# EAGLE design PAPR_02 (EAGLE 7.4.0)
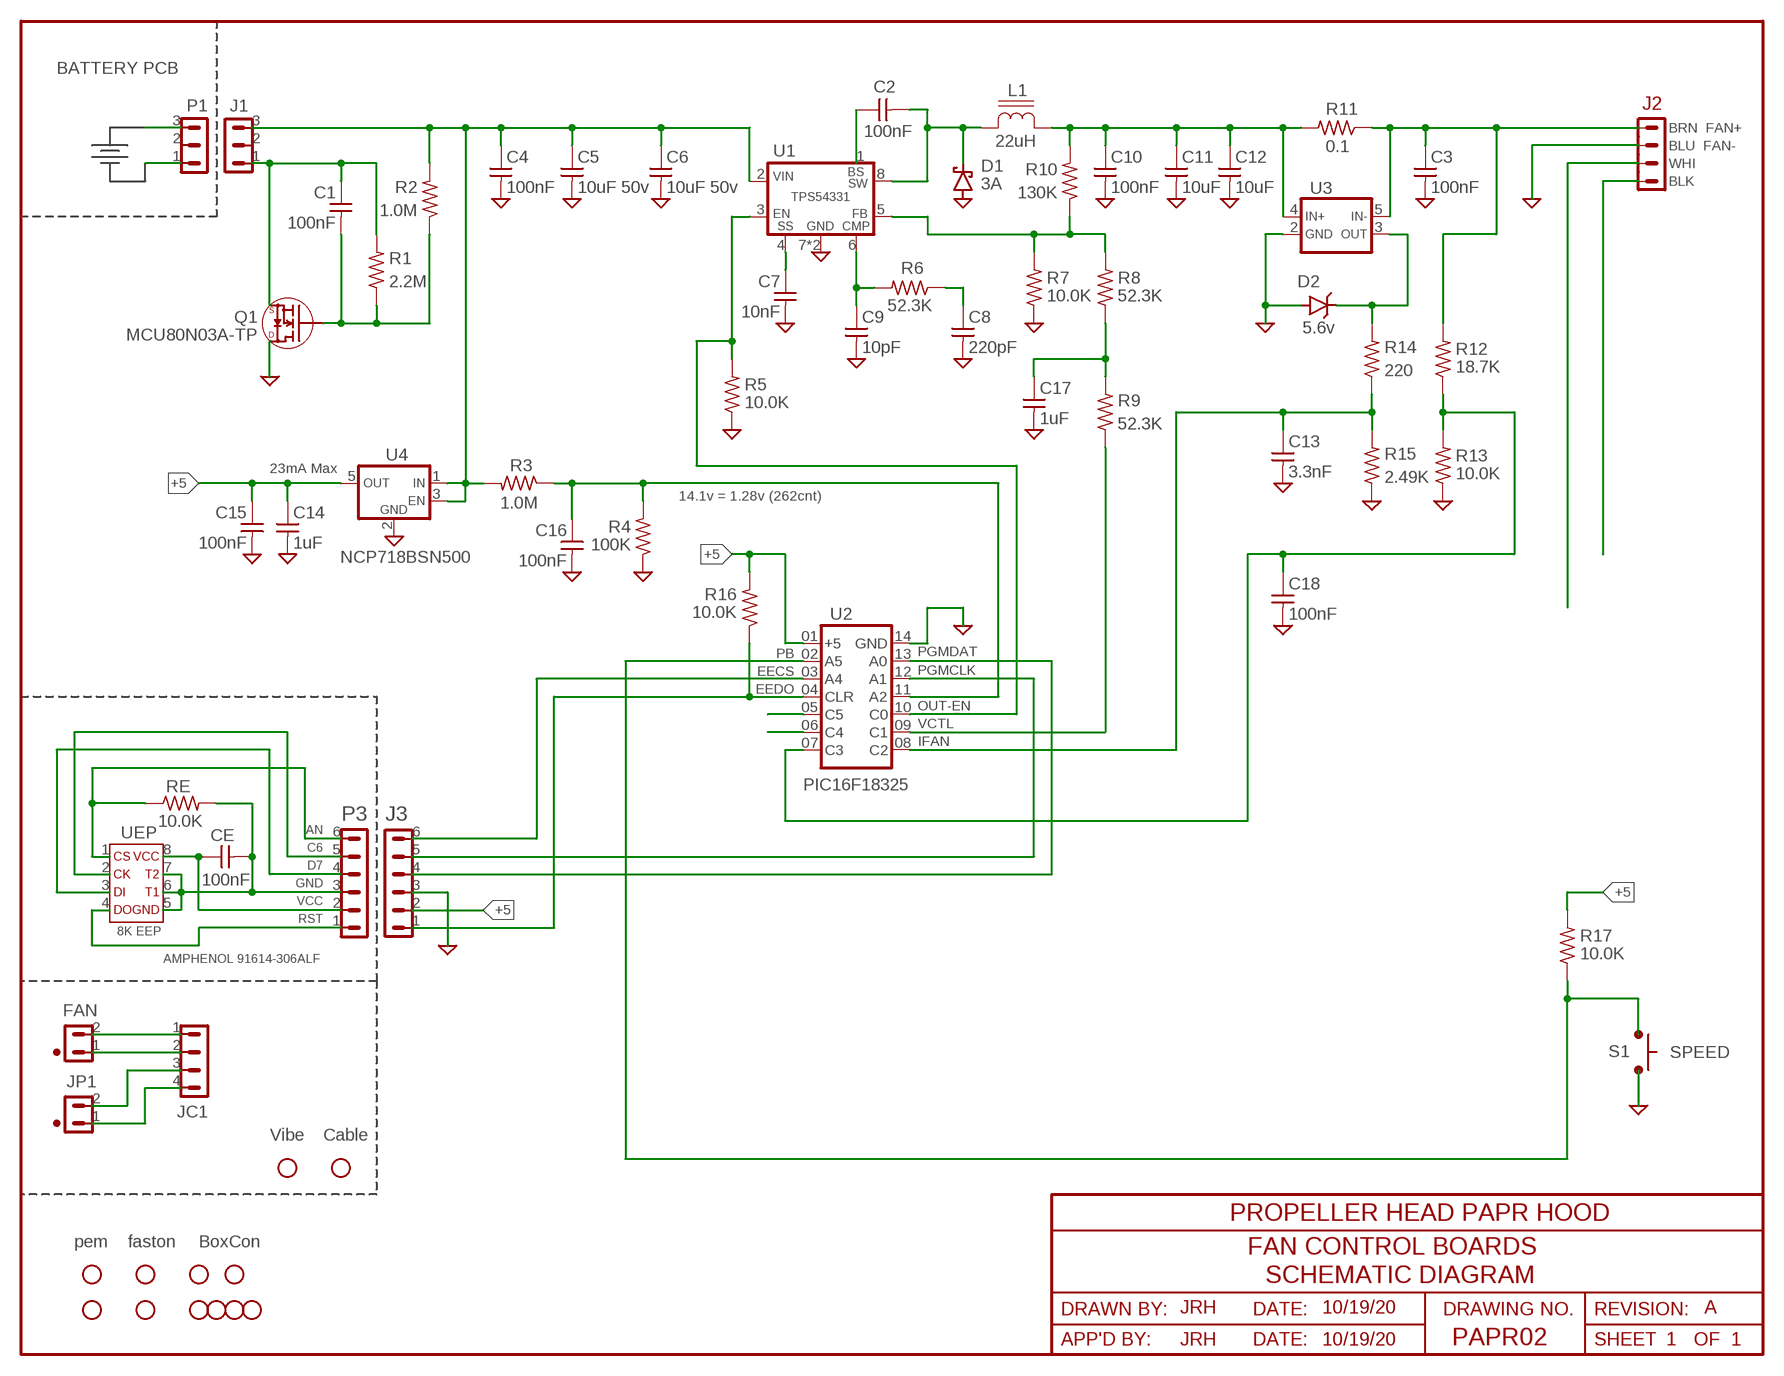
[diagram p0: schematic, sheet 1]

## Parts
BOM1  pem  BOM_ADDER  [BOM_ADDER]
BOM2  pem  BOM_ADDER  [BOM_ADDER]
BOM3  faston  BOM_ADDER  [BOM_ADDER]
BOM4  faston  BOM_ADDER  [BOM_ADDER]
BOM5  vibrator  BOM_ADDER  [BOM_ADDER]
BOM6  BoxCon  BOM_ADDER  [BOM_ADDER]
BOM7  Cable  BOM_ADDER  [BOM_ADDER]
BOM8  Plug  BOM_ADDER  [BOM_ADDER]
BOM9  Pin  BOM_ADDER  [BOM_ADDER]
BOM10  Pin  BOM_ADDER  [BOM_ADDER]
BOM11  Pin  BOM_ADDER  [BOM_ADDER]
BOM12  Pin  BOM_ADDER  [BOM_ADDER]
C1  100nF  C-N0805  [R0805]
C2  100nF  C-N0805  [R0805]
C3  100nF  C-N0805  [R0805]
C4  100nF  C-N0805  [R0805]
C5  10uF 50v  C-N1210  [R1210]
C6  10uF 50v  C-N1210  [R1210]
C7  10nF  C-N0805  [R0805]
C8  220pF  C-N0805  [R0805]
C9  10pF  C-N0805  [R0805]
C10  100nF  C-N0805  [R0805]
C11  10uF  C-N1210  [R1210]
C12  10uF  C-N1210  [R1210]
C13  3.3nF  C-N0805  [R0805]
C14  1uF  C-N0805  [R0805]
C15  100nF  C-N0805  [R0805]
C16  100nF  C-N0805  [R0805]
C17  1uF  C-N0805  [R0805]
C18  100nF  C-N0805  [R0805]
CE  100nF  C-N0805  [R0805]
D1  3A  DIODES-1A  [SMA]
D2  5.6v  ZENER3  [SOT23-3]
FAN  Fan_Hdr  HDR02V  [641215-2]
J1  bat  HDR03_17  [1746142]
J2-BLK  WIRE-HDRS200  [PADS200]
J2-BLU  WIRE-HDRS200  [PADS200]
J2-BRN  WIRE-HDRS200  [PADS200]
J2-WHI  WIRE-HDRS200  [PADS200]
J3  6p  HDR06R  [J06P]
JC1  Cable_Termination  HDR04_JST_B4P-VH  [B4P-VH]
JP1  Spare  HDR02V  [641215-2]
L1  22uH  COIL1048  [SRU1048]
P1  bat  HDR03_17M  [1746142M]
P3  6p plug  HDR06R  [J06P]
Q1  MCU80N03A-TP  IGFETNM  [TO252]
R1  2.2M  R0805  [R0805]
R2  1.0M  R0805  [R0805]
R3  1.0M  R0805  [R0805]
R4  100K  R0805  [R0805]
R5  10.0K  R0805  [R0805]
R6  52.3K  R0805  [R0805]
R7  10.0K  R0805  [R0805]
R8  52.3K  R0805  [R0805]
R9  52.3K  R0805  [R0805]
R10  130K  R0805  [R0805]
R11  0.1  R2512  [R2512]
R12  18.7K  R0805  [R0805]
R13  10.0K  R0805  [R0805]
R14  220  R0805  [R0805]
R15  2.49K  R0805  [R0805]
R16  10.0K  R0805  [R0805]
R17  10.0K  R0805  [R0805]
RE  10.0K  R0805  [R0805]
S1  SPEED  PUSHBUTTONQ  [EVQ-P7C01P]
U1  TPS54331  TPS54331DDAR  [SO08PW]
U2  PIC16F18325  PIC16F616-I/SL  [SOIC14]
U3  ZXCT1010  ZXCT1010E5TA  [SOT23-5]
U4  NCP718BSN500  LP2981AIM  [SOT23-5]
UEP  4K EEP  BR93H76RFJ-2CE  [SO08]

## Nets
+5: C14.1 C15.1 J3.2 R16.1 R17.1 U2.01(VCC) U4.5(OUT)
BAT+: C4.1 C5.1 C6.1 J1.3 R2.1 R3.1 U1.2(VIN) U4.1(IN) U4.3(EN)
BAT-: C1.1 J1.1 Q1.2(S) R1.1
BATT+: P1.3
BATT-: P1.1
BOOST: C2.1 U1.1(BS)
CMP: C9.1 R6.1 U1.6(CMP)
ECK: P3.5 UEP.2(SK)
ECS: P3.6 RE.2 UEP.1(CS)
EDI: P3.4 UEP.3(DI)
EDO: P3.1 UEP.4(DO)
EECS: J3.6 U2.03(A4)
EEDO: J3.1 R16.2 U2.04(CLR)
EGND: CE.2 P3.3 RE.1 UEP.5(GND) UEP.6(T1) UEP.7(T2)
FB: R7.1 R8.1 R10.2 U1.5(FB)
GND: C3.2 C4.2 C5.2 C6.2 C7.2 C8.2 C9.2 C10.2 C11.2 C12.2 C13.2 C14.2 C15.2 C16.2 C17.2 C18.2 D1.A D2.1(A) J2-BLU.1 J3.3 Q1.3(D) R4.2 R5.2 R7.2 R13.2 R15.2 S1.1 S1.2 U1.7(GND) U1.9(GND) U2.14(GND) U3.2(GND) U4.2(GND)
IFAN: C13.1 R14.2 R15.1 U2.08(C2)
J2-3: J2-WHI.1
J2-4: J2-BLK.1
N$1: C1.2 Q1.1(G) R1.2 R2.2
N$3: CE.1 P3.2 UEP.8(VCC)
N$4: C3.1 J2-BRN.1 R11.2 R12.1 U3.5(IN-)
N$5: C18.1 R12.2 R13.1 U2.07(C3)
N$6: D2.3(C) R14.1 U3.3(OUT)
N$9: C8.1 R6.2
N$42: FAN.2 JC1.1
N$43: FAN.1 JC1.2
N$44: JC1.3 JP1.2
N$45: JC1.4 JP1.1
OUT+: C10.1 C11.1 C12.1 L1.2 R10.1 R11.1 U3.4(IN+)
OUT-EN: R5.1 U1.3(EN) U2.10(C0)
PB: R17.2 S1.3 S1.4 U2.02(A5)
PGMCLK: J3.5 U2.12(A1)
PGMDAT: J3.4 U2.13(A0)
PWMF: C17.1 R8.2 R9.1
SS: C7.1 U1.4(SS)
SW: C2.2 D1.C L1.1 U1.8(SW)
U2-05: U2.05(C5)
U2-06: U2.06(C4)
VBAT: C16.1 R3.2 R4.1 U2.11(A2)
VCTL: R9.2 U2.09(C1)
Unconnected: J1.2 P1.2

## Notes on the sheet
- BATTERY PCB
- J2
- BRN  FAN+
- BLU  FAN-
- WHI
- BLK
- 23mA Max
- 14.1v = 1.28v (262cnt)
- AN
- C6
- D7
- GND
- VCC
- RST
- 8K EEP
- AMPHENOL 91614-306ALF
- Vibe | Cable
- PROPELLER HEAD PAPR HOOD
- pem | faston | BoxCon
- FAN CONTROL BOARDS
- SCHEMATIC DIAGRAM
- JRH | 10/19/20 | A
- JRH | 10/19/20 | PAPR02 | 1 | 1

## Library data of the parts
BOM1 BOM2 = 0_Misc:BOM_ADDER: Add lines to BOM; DESC: PEM Fastener; MFG: PEM Engineering; PART_NUMBER: KF2-440-ET; PRICE: 0.40; SUPPLIER: ???
BOM3 BOM4 = 0_Misc:BOM_ADDER: Add lines to BOM; DESC: Terminal, Faston 0.250; MFG: Keystone; PART_NUMBER: 4901; PRICE: 0.1874; SUPPLIER: Digikey 36-4901-ND
BOM5 = 0_Misc:BOM_ADDER: Add lines to BOM; DESC: Vibrator; MFG: Jinlong; PART_NUMBER: Z6SCAB0061141; PRICE: 2.657; SUPPLIER: Digikey 1670-1021-ND
BOM6 = 0_Misc:BOM_ADDER: Add lines to BOM; DESC: Connector,Circular,4p; MFG: TE; PART_NUMBER: T4070014041-001; PRICE: 6.9932; SUPPLIER: Digikey A126812-ND
BOM7 = 0_Misc:BOM_ADDER: Add lines to BOM; DESC: Cable,Circular,4p; MFG: TE; PART_NUMBER: 1-2273003-1; PRICE: 10.3224; SUPPLIER: Digikey A120949-ND
BOM8 = 0_Misc:BOM_ADDER: Add lines to BOM; DESC: Plug,4p,MicroMate 3mm c-c; MFG: TE; PART_NUMBER: 1445022-4; PRICE: 0.3464; SUPPLIER: Digikey A30260-ND
BOM9-BOM12 = 0_Misc:BOM_ADDER: Add lines to BOM; DESC: Terminal,male,MicroMate,gold,30u; MFG: TE; PART_NUMBER: 1-794606-1; PRICE: 0.1049; SUPPLIER: Digikey A100439CT-ND
C1-C4 C10 C15 C16 C18 CE = 0_SMT:C-N: Capacitor, Vertical Non-Polarized; DESC: Capacitor,100nF,50v, MonoCer,X7R,10%; MFG: Samsung AVX; PART_NUMBER: CL21B104KBC5PNL 08055C104KAT4A; PRICE: 0.0317; SUPPLIER: Digikey 1276-7000-1-ND 478-10836-1-ND
C5 C6 = 0_SMT:C-N: Capacitor, Vertical Non-Polarized; DESC: Capacitor,10uF,50v, MonoCer,X7R,10%; MFG: TDK; PART_NUMBER: C3225X7R1H106M250AC; PRICE: 0.822; SUPPLIER: Digikey 445-14933-1-ND
C7 = 0_SMT:C-N: Capacitor, Vertical Non-Polarized; DESC: Capacitor,10nF,50v, MonoCer,X7R,10%; MFG: Samsung AVX; PART_NUMBER: CL21B103KBANNNC C0805C103K1RAC7210; PRICE: 0.052; SUPPLIER: Digikey 1276-1015-1-ND
C8 = 0_SMT:C-N: Capacitor, Vertical Non-Polarized; DESC: Capacitor,220pF,50v, MonoCer,C0G,5%; MFG: Samsung Venkel; PART_NUMBER: CL21C221JBANNNC C0805C0G500-221JNE; PRICE: 0.051; SUPPLIER: Digikey 1276-1164-1-ND
C9 = 0_SMT:C-N: Capacitor, Vertical Non-Polarized; DESC: Capacitor,10pF,50v, MonoCer,NPO,10%; MFG: Kemet Stackpole; PART_NUMBER: C0805C100K5GACTU CML0805C0G100JT50V; PRICE: 0.081; SUPPLIER: Digikey 399-7975-1-ND
C11 C12 = 0_SMT:C-N: Capacitor, Vertical Non-Polarized; DESC: Capacitor,10uF,25v, MonoCer,X7R,10%; MFG: Samsung Taiyo Yuden; PART_NUMBER: CL32A106KAULNNE TMK325BJ106KN-T; PRICE: 0.231; SUPPLIER: Digikey 1276-1854-1-ND 587-5950-1-ND
C13 = 0_SMT:C-N: Capacitor, Vertical Non-Polarized; DESC: Capacitor,3.3nF,50v, MonoCer,X7R,10%; MFG: Kemet; PART_NUMBER: C0805C332K5RACTU; PRICE: 0.064; SUPPLIER: Digikey 399-1153-1-ND
C14 C17 = 0_SMT:C-N: Capacitor, Vertical Non-Polarized; DESC: Capacitor,1uF,50v, MonoCer,X7R,10%; MFG: Samsung Taiyo Yuden; PART_NUMBER: CL21B105KOFNNNG EMK212B7105KG-T; PRICE: 0.063; SUPPLIER: Digikey 1276-6471-1-ND
D1 = 0_SMT:DIODES: Diode Schottky; DESC: Diode,3A,40V,Schottky,SMA; MFG: Diodes Inc OnSemi Vishay; PART_NUMBER: B340A-13-F MBRA340T3G SSA34HE3_A/I; PRICE: 0.191; SUPPLIER: Digikey B340A-FDICT-ND MBRA340T3GOSCT-ND SSA34HE3_A/IGICT-ND
D2 = 0_SMT:ZENER: Zener SMT; DESC: Zener,5.6v,250mW,SOT23-3; MFG: On Semi; PART_NUMBER: SZBZX84-C5V6LT1G; PRICE: 0.118; SUPPLIER: Digikey SZBZX84C5V6LT1GOSCT-ND
FAN JP1 = 0_Con:HDR02: 2pin Headers; DESC: Header,2 pin, 0.100cc; MFG: Tyco; PART_NUMBER: 641215-2; PRICE: ??; SUPPLIER: ??
J1 = 0_Con:HDR03: 3pin Headers; DESC: Header,3 pin, 3.2mmcc Leaf Spring; MFG: TI; PART_NUMBER: 1745142-1; PRICE: 1.647; SUPPLIER: Digikey A107932CT-ND
J2-BLK J2-BLU J2-BRN J2-WHI = 0_Con:WIRE-HDR: Wire Pads; DESC: Connection,10-32; MFG: ??; PART_NUMBER: ??; PRICE: ??; SUPPLIER: ??
J3 = 0_Con:HDR06: Header 6 pin; DESC: Header,6p,thru,gold,8.89mm; MFG: Samtec; PART_NUMBER: MTSW-106-22-G-S-350; PRICE: 0.750; SUPPLIER: Digikey MTSW-106-22-G-S-350-ND
JC1 = 0_Con:HDR04: 4pin Headers; DESC: Header,4 pin; MFG: JST; PART_NUMBER: B4P-VH; PRICE: ??; SUPPLIER: ??
L1 = 0_SMT:COIL: Inductor; DESC: Inductor,uH,10mm Octal; MFG: Bourns; PART_NUMBER: SDR1048-; PRICE: 0.6756; SUPPLIER: Digikey SRU1048-220YCT-ND
P1 = 0_Con:HDR03: 3pin Headers; DESC: Header,3 pin, 3.2mmcc Leaf Spring MATE; MFG: TI; PART_NUMBER: 1745142-1 Mate
P3 = 0_Con:HDR06: Header 6 pin; DESC: Header, 6pin; MFG: ??; PART_NUMBER: ??; PRICE: ??; SUPPLIER: ??
Q1 = 0_SMT:IGFETN: N-Channel MOSFET; DESC: MOSFET,N-Ch,30v,<18m; MFG: MCC Diodes Inc On Semi; PART_NUMBER: MCU80N03A-TP DMG4800LK3-13 NTD4969NT4G; PRICE: 0.40; SUPPLIER: Digikey 353-MCU80N03A-TPCT-ND
R1 = 0_SMT:R: Resistor; DESC: Resistor,2.2M,1/8w,1%; MFG: Stackpole Vishay; PART_NUMBER: RMCF0805FT2M21 CRCW08052M20FKEA; PRICE: 0.0143; SUPPLIER: Digikey RMCF0805FT2M21CT-ND
R2 = 0_SMT:R: Resistor; DESC: Resistor,1.0M,1/8w,1%; MFG: Stackpole KOA Speer; PART_NUMBER: RMCF0805FG1M00 RK73H2ATTD1004F; PRICE: 0.0104; SUPPLIER: Digikey RMCF0805FG1M00CT-ND 2019-RK73H2ATTD1004FCT-ND
R3 = 0_SMT:R: Resistor; DESC: Resistor,1.0M,1/8w,1%; MFG: Stackpole Vishay; PART_NUMBER: RMCF0805FT2M21 CRCW08052M20FKEA; PRICE: 0.0143; SUPPLIER: Digikey RMCF0805FT2M21CT-ND 541-2.20MCCT-ND
R4 = 0_SMT:R: Resistor; DESC: Resistor,100K,1/8w,1%; MFG: Stackpole KOA Speer; PART_NUMBER: RMCF0805FG100K RK73H2ATTD1003F; PRICE: 0.0104; SUPPLIER: Digikey RMCF0805FT100KTR-ND
R5 R7 R13 R16 R17 RE = 0_SMT:R: Resistor; DESC: Resistor,10.0K,1/8w,1%; MFG: Stackpole KOA Speer; PART_NUMBER: RMCF0805FT10K0 RK73H2ATTD1002F; PRICE: 0.0104; SUPPLIER: Digikey RMCF0805FT10K0CT-ND
R6 R8 R9 = 0_SMT:R: Resistor; DESC: Resistor,52.3K,1/8w,1%; MFG: Yageo Vishay; PART_NUMBER: RC0805FR-0752K3L CRCW080552K3FKEA; PRICE: 0.0163; SUPPLIER: Digikey 311-52.3KCRCT-ND
R10 = 0_SMT:R: Resistor; DESC: Resistor,130K,1/8w,1%; MFG: KOA Speer Yageo; PART_NUMBER: RK73H2ATTD1303F RC0805FR-07130KL; PRICE: 0.0136; SUPPLIER: Digikey 2019-RK73H2ATTD1303FCT-ND
R11 = 0_SMT:R: Resistor; DESC: Resistor,0.1,2w,1%; MFG: Stackpole; PART_NUMBER: CSRN2512FTR100; PRICE: 0.462; SUPPLIER: Digikey CSRN2512FTR100CT-ND
R12 = 0_SMT:R: Resistor; DESC: Resistor,18.7K,1/8w,1%; MFG: Stackpole Yageo; PART_NUMBER: RMCF0805FT18K7 RC0805FR0718K7L; PRICE: 0.0104; SUPPLIER: Digikey RMCF0805FT18K7CT-ND
R14 = 0_SMT:R: Resistor; DESC: Resistor,220,1/8w,1%; MFG: Stackpole KOA Speer; PART_NUMBER: RMCF0805FT220R RK73H2ATTD2200F; PRICE: 0.0104; SUPPLIER: Digikey RMCF0805FT220RCT-ND
R15 = 0_SMT:R: Resistor; DESC: Resistor,2.49K,1/8w,1%; MFG: Stackpole Vishay; PART_NUMBER: RMCF0805FT2K49 CRCW08052K49FKEA; PRICE: 0.0104; SUPPLIER: Digikey RMCF0805FT2K49CT-ND
S1 = 0_SMT:PUSHBUTTON: PushButton,SMT; DESC: PushButton,Low Profile,Rt Angle; MFG: Panasonic; PART_NUMBER: EVQ-P7C01P; PRICE: 0.320; SUPPLIER: Digikey P16765CT-ND
U1 = 0_Misc_Analog:TPS54331: 25v 3A Switching regulator; DESC: Switching Regulator,3A,25v; MFG: TI; PART_NUMBER: TPS54331DDAR; PRICE: 1.352; SUPPLIER: Digikey 296-39419-1-ND
U2 = 0_Micro:PIC16F616: 8 Bit microprocessor; DESC: Microcontroller,8bit,14pin; MFG: Microchip; PART_NUMBER: PIC16F18325-I/SL; PRICE: 0.980; SUPPLIER: Digikey PIC16F18325-I/SL-ND
U3 = 0_Misc_Analog:ZXCT1010: Hi-Side Amps Monitor; DESC: Hi-Side Amps Monitor; MFG: DiodesInc; PART_NUMBER: ZXCT1010E5TA; PRICE: 1.025; SUPPLIER: Digikey ZXCT1010CT-ND
U4 = 0_Misc_Analog:LP2981: Low Dropout regulator w/shutdown; DESC: Regulator,LoQ,5.0v,25vIn; MFG: On Semi; PART_NUMBER: NCP718BSN500T1G; PRICE: 0.338; SUPPLIER: Digikey NCP718BSN500T1GOSCT-ND
UEP = 0_Misc_Digital:BR93H76: BR93H76 Serial 8K EEPROM; DESC: Serial EEPROM, 8K; MFG: ROHM Semi; PART_NUMBER: BR93H76RFJ-2CE; PRICE: 0.00413; SUPPLIER: Digikey BR93H76RFJ-2CE2CT-ND

## Board
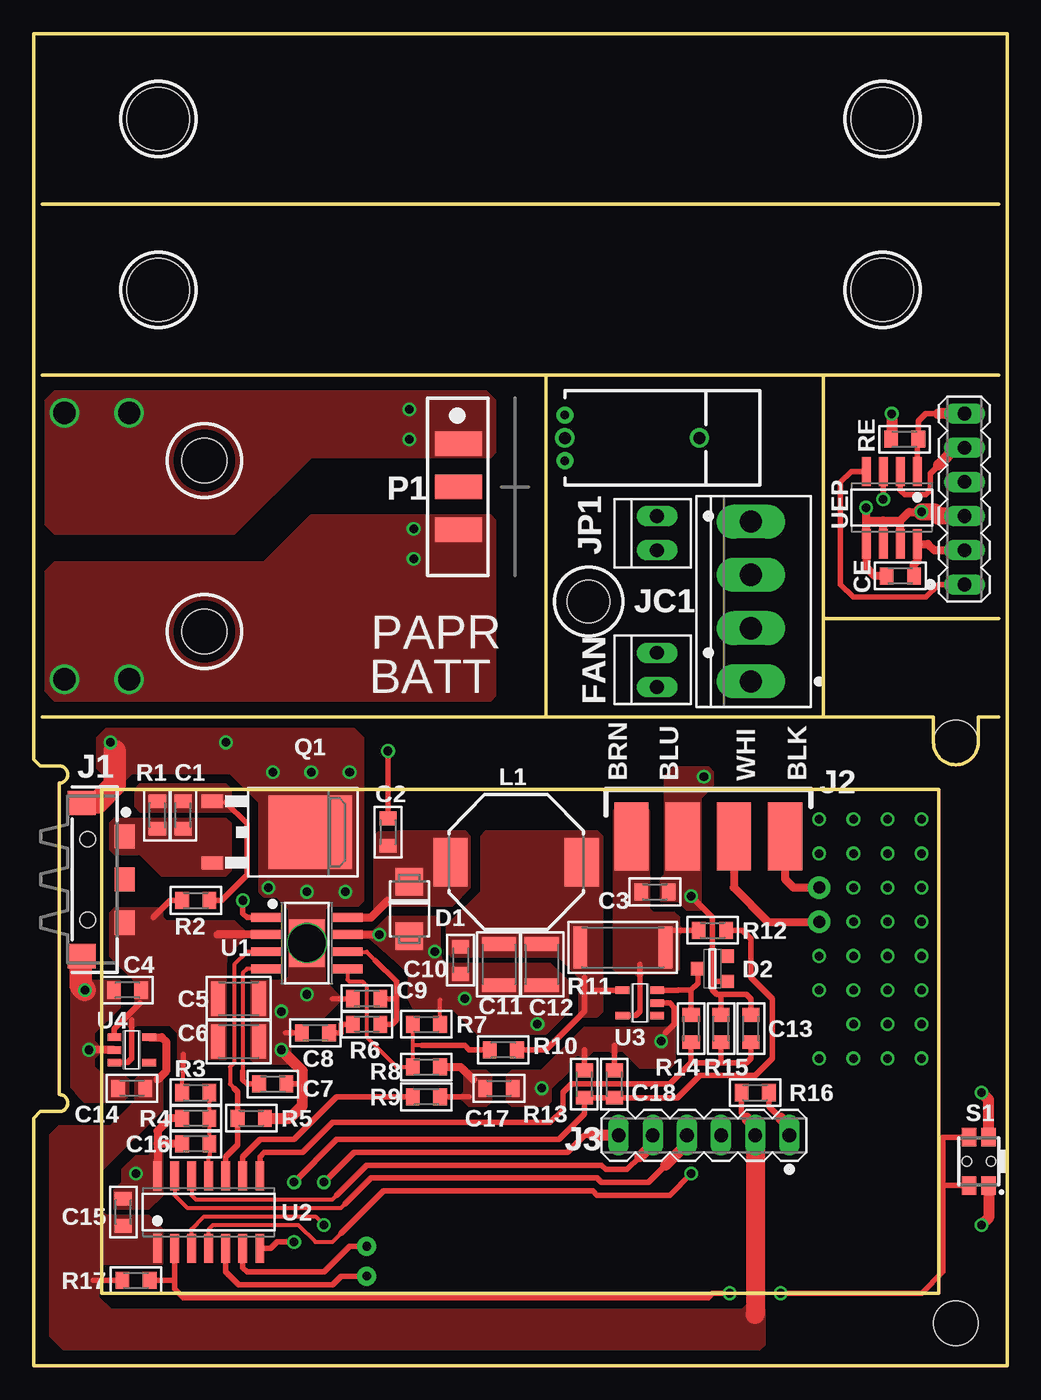
[diagram p1: board, top side]
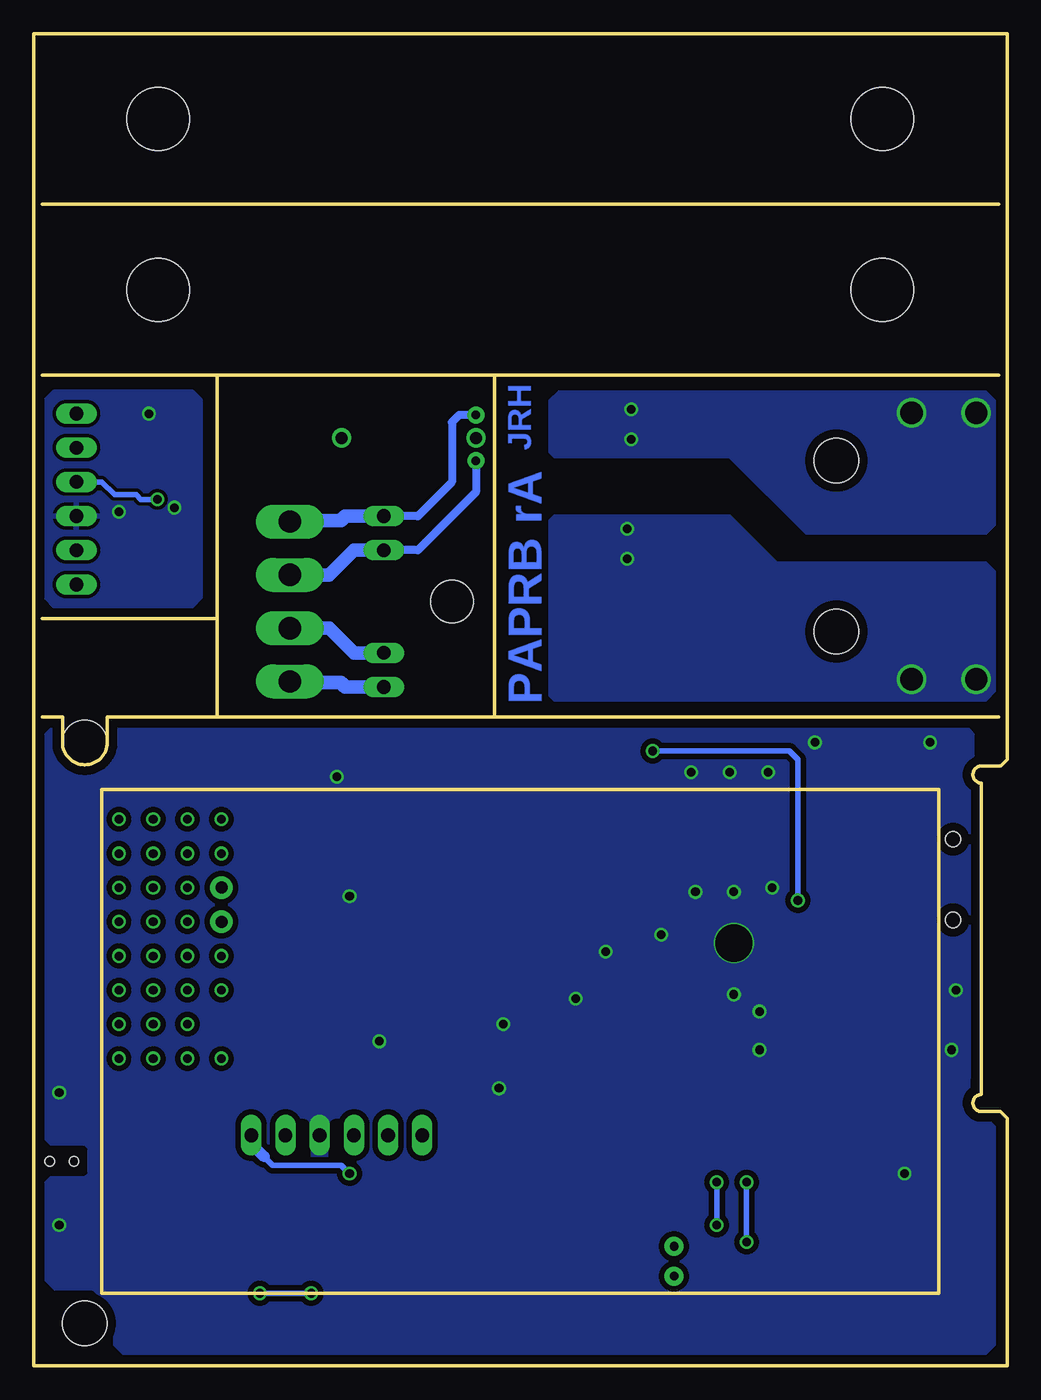
[diagram p2: board, bottom side, seen from below]

Size 72.39 x 99.06 mm. Coordinates in mm from the lower left corner, seen from the top.
Outline: 38.1,48.26 38.1,73.66
Outline: 71.75,73.66 58.74,73.66
Outline: 58.74,73.66 38.1,73.66
Outline: 38.1,73.66 0.64,73.66
Outline: 0.64,48.26 38.1,48.26
Outline: 38.1,48.26 58.74,48.26
Outline: 58.74,48.26 66.92,48.26 66.92,46.35 arc180 70.24,46.36 70.24,48.26 71.75,48.26
Outline: 71.75,55.56 58.74,55.56
Outline: 58.74,55.56 58.74,73.66
Outline: 58.74,48.26 58.74,55.56
Outline: 71.75,86.36 0.64,86.36
Outline: 0,99.06 0,45.09 0.48,44.6 1.91,44.6 arc-180 1.91,43.33 1.91,20.18 arc-180 1.91,18.91 0.49,18.91 0,18.41 0,0 72.39,0 72.39,99.06 0,99.06
Copper layers (1*16): Top 0.035mm / dielectric 1.5mm / Bottom 0.035mm
Design rules "jrhL2_SOIC_HS": minimum track width 10mil, minimum drill 13mil, track to track 8mil, track to pad 7mil, pad to pad 7mil, via to via 10mil, smd to smd 7mil, copper to edge 25mil, drill to drill 8mil, minimum pad ring 8mil, minimum via ring 4mil, stop-mask expansion 4mil, vias tented up to drill 0mil, thermal gap 10mil
Holes 3.33 mm at 12.7,67.31 12.7,54.61 68.58,3.17 68.58,46.35
Holes 4.67 mm at 9.27,80.01 63.12,80.01 9.27,92.71 63.12,92.71
Holes 3.17 mm at 41.27,56.83
bRestrict: 2 lines
Milling: 4 lines

### Footprints (pad centres in the part's own frame; a part is rotated, then mirrored left to right if it is on the bottom)
R0805 = smd 1.016 x 1.27: 1 -1.016,0; 2 1.016,0
R1210 = smd 1.016 x 2.54: 1 -1.524,0; 2 1.524,0
SMA = smd 2.032 x 2.032: A 2.032,0; C -2.032,0
SOT23-3 = smd 0.991 x 0.991: 1 -1.092,0.94; 2 -1.092,-0.94; 3 1.092,0
641215-2 = drill 1.016 pad 1.524 long: 1 -1.27,0; 2 1.27,0
1746142 = smd 1.5 x 1.8: 1 2.4,3.2; 2 2.4,0; 3 2.4,-3.2 | smd 2.1 x 1.8: 4 -0.8,-5.7; 5 -0.8,5.7 | hole 1.15: -0.35,-3; -0.35,3
PADS200 = smd 5.08 x 2.54: 1 0,0
J06P = drill 1.016 pad 1.524 long: 1 -6.35,0; 2 -3.81,0; 3 -1.27,0; 4 1.27,0; 5 3.81,0; 6 6.35,0
B4P-VH = drill 1.651 pad 2.54 long: 1 -5.944,0; 2 -1.981,0; 3 1.981,0; 4 5.944,0
SRU1048 = smd 2.54 x 3.607: 1 -4.877,0; 2 4.877,0
1746142M = smd 3.5 x 1.8: 1 -4.2,3.2; 2 -4.2,0; 3 -4.2,-3.2
TO252 = smd 1.6 x 0.991: 1 -4.801,2.286; 2 -4.801,-2.286 | smd 6.198 x 5.461: 3 2.489,0
R2512 = smd 1.016 x 3.099: 1 -3.175,0; 2 3.175,0
EVQ-P7C01P = smd 1.05 x 1.4: 1 -0.725,1.8; 2 -0.725,-1.8; 3 0.725,-1.8; 4 0.725,1.8 | hole 0.7: -0.9,0; 0.9,0
SO08PW = smd 2.261 x 0.66: 1 -3.023,1.905; 2 -3.023,0.635; 3 -3.023,-0.635; 4 -3.023,-1.905; 5 3.023,-1.905; 6 3.023,-0.635; 7 3.023,0.635; 8 3.023,1.905 | smd 2.616 x 3.505: 9 0,0
SOIC14 = smd 0.66 x 2.159: 01 -3.81,-2.692; 02 -2.54,-2.692; 03 -1.27,-2.692; 04 0,-2.692; 05 1.27,-2.692; 06 2.54,-2.692; 07 3.81,-2.692; 08 3.81,2.692; 09 2.54,2.692; 10 1.27,2.692; 11 0,2.692; 12 -1.27,2.692; 13 -2.54,2.692; 14 -3.81,2.692
SOT23-5 = smd 0.559 x 1.016: 1 -0.94,-1.295; 2 0,-1.295; 3 0.94,-1.295; 4 0.94,1.295; 5 -0.94,1.295
SO08 = smd 0.66 x 2.159: 1 -1.905,-2.692; 2 -0.635,-2.692; 3 0.635,-2.692; 4 1.905,-2.692; 5 1.905,2.692; 6 0.635,2.692; 7 -0.635,2.692; 8 -1.905,2.692

### Placement (x,y rotation side)
BOM1  23.81,74.93 0 top
BOM2  22.86,74.93 0 top
BOM3  23.81,65.41 0 top
BOM4  22.86,65.41 0 top
BOM5  34.92,75.25 0 top
BOM6  31.43,82.55 0 top
BOM7  30.48,81.28 0 top
BOM8  29.53,80.01 0 top
BOM9  28.57,78.74 0 top
BOM10  27.62,77.47 0 top
BOM11  26.67,76.2 0 top
BOM12  25.72,74.93 0 top
C1  11.11,40.96 90 top
C2  26.35,39.69 270 top
C3  46.2,35.24 0 top
C4  6.99,27.94 180 top
C5  15.24,27.3 0 top
C6  15.24,24.13 0 top
C7  17.78,20.95 0 top
C8  20.95,24.77 180 top
C9  24.77,27.3 180 top
C10  31.75,30.16 270 top
C11  34.61,29.84 270 top
C12  37.78,29.84 270 top
C13  53.34,25.08 90 top
C14  7.3,20.64 180 top
C15  6.67,11.43 90 top
C16  12.06,16.51 180 top
C17  34.61,20.64 0 top
C18  43.18,20.95 90 top
CE  64.45,58.74 180 top
D1  27.94,33.97 270 top
D2  50.48,29.53 180 top
FAN  46.35,51.75 270 top
J1  4.37,36.16 0 top
J2-BLK  55.88,39.37 90 top
J2-BLU  48.26,39.37 90 top
J2-BRN  44.45,39.37 90 top
J2-WHI  52.07,39.37 90 top
J3  49.85,17.14 180 top
JC1  53.34,56.83 90 top
JP1  46.35,61.91 270 top
L1  35.88,37.47 0 top
P1  35.8,65.36 0 top
P3  69.22,64.45 90 top
Q1  18.1,39.69 0 top
R1  9.21,40.96 90 top
R2  12.06,34.61 0 top
R3  12.06,20.32 0 top
R4  12.06,18.41 180 top
R5  16.19,18.41 0 top
R6  24.77,25.4 180 top
R7  29.21,25.4 0 top
R8  29.21,22.23 0 top
R9  29.21,20 180 top
R10  34.92,23.5 180 top
R11  43.81,31.11 0 top
R12  50.48,32.38 0 top
R13  40.96,20.95 90 top
R14  48.9,25.08 270 top
R15  51.12,25.08 90 top
R16  53.66,20.32 0 top
R17  7.62,6.35 0 top
RE  64.77,68.9 0 top
S1  70.29,15.21 180 top
U1  20.32,31.43 0 top
U2  13.02,11.43 0 top
U3  45.09,26.99 90 top
U4  7.3,23.5 270 top
UEP  63.82,63.82 180 top

### Tracks (layer width: path | path; a pad name or v marks a point on that pad's centre or on a via)
+5
  Top 0.406: R17.1 4.45,6.35 | R16.1 52.64,18.8 53.02,18.41
  Top 0.61: U4.5 9.54,24.43 9.84,24.13 9.84,21.91 9.21,21.27
  Top 0.813: J3.2 53.66,17.78 53.02,18.41
  Top 1.422: J3.2 53.66,3.81
  pour Top (isolate 0.406, no thermals): 1.27,2.22 1.27,17.14 1.91,17.78 5.71,17.78 7.62,19.68 7.62,21.27 7.94,21.59 9.53,21.59 9.53,19.05 5.08,14.61 5.08,11.43 5.4,11.11 8.57,11.11 9.53,10.16 9.53,7.62 5.08,7.62 4.76,7.3 4.76,6.67 5.08,6.35 4.76,6.03 4.76,5.08 5.71,4.13 52.7,4.13 53.34,4.76 53.66,4.76 54.29,4.13 54.29,1.59 53.98,1.27 2.22,1.27
BAT+
  Top 0.305: R3.1 11.05,21.21 11.11,21.27 11.11,21.91
  Top 0.406: R2.1 10.16,34.61 8.89,33.34 | U4.1 6.01,25.06 7.94,26.99 | 11.11,21.91 11.11,23.18 | U4.3 7,22.55 7.3,22.86 7.3,25.72
  Top 0.61: U1.2 13.65,32.07
  pour Top (isolate 0.406, rank 4, no thermals): 7.62,26.67 7.62,28.57 5.71,30.48 5.71,33.66 6.03,33.97 9.53,33.97 9.53,33.34 9.84,33.02 14.92,33.02 15.88,32.07 14.29,30.48 14.29,22.86 11.43,22.86 11.11,22.54 10.79,22.86 10.79,24.77 10.16,25.4 7.62,25.4 7.3,25.08 6.99,25.4 6.35,25.4
BAT-
  pour Top (isolate 0.406, rank 2, no thermals): 14.29,36.51 9.53,36.51 7.94,38.1 6.03,38.1 5.71,38.42 5.71,40.32 6.03,40.64 14.29,40.64 14.61,40.32 14.61,36.83
BATT+  (via drill 0.64 pad 1.02, 1.65 pad 2.18)
  other vias: 2.3,51.06 7.1,51.06 28.26,62.23 28.26,60.01
  pour Top (isolate 0.254): 0.95,59.05 0.95,50.16 1.59,49.53 33.97,49.53 34.29,49.85 34.29,62.87 33.97,63.18 20.64,63.18 17.14,59.69 1.59,59.69
  pour Bottom (isolate 0.254): 0.95,59.05 0.95,50.16 1.59,49.53 33.66,49.53 33.97,49.85 33.97,62.87 33.66,63.18 20.64,63.18 17.14,59.69 1.59,59.69
BATT-  (via drill 0.64 pad 1.02, 1.65 pad 2.18)
  other vias: 2.3,70.86 7.1,70.86 27.94,68.9 27.94,71.12
  pour Top (isolate 0.254): 0.95,62.55 0.95,71.75 1.59,72.39 33.66,72.39 34.29,71.75 34.29,67.94 33.97,67.63 20.64,67.63 14.92,61.91 1.59,61.91
  pour Bottom (isolate 0.254): 0.95,62.55 0.95,71.75 1.59,72.39 33.34,72.39 33.97,71.75 33.97,67.94 33.66,67.63 20.64,67.63 14.92,61.91 1.59,61.91
BOOST  (via drill 0.64 pad 1.02)
  Top 0.406: U1.1 15.88,33.34 15.56,33.66 v15.56,34.61 | C2.1 v26.35,45.72
  Bottom 0.406: v15.56,34.61 15.56,45.09 16.19,45.72 v26.35,45.72
CMP
  Top 0.305: U1.6 24.77,30.8 25.4,30.16
  Top 0.406: R6.1 26.67,25.4 26.99,25.72 26.99,27.3 | 26.99,27.3 26.99,28.57 25.4,30.16 | C9.1 26.99,27.3
ECK
  Top 0.406: UEP.2 64.45,65.09 64.77,64.77 66.36,64.77 66.67,65.09 66.67,66.36 67.31,66.99
  Top 0.813: P3.5 68.58,68.26 67.31,66.99
ECS
  Top 0.406: UEP.1 65.72,68.83 RE.2 65.79,70.23 66.36,70.8 67.31,70.8
  Top 0.813: P3.6 67.31,70.8
EDI  (via drill 0.64 pad 1.02)
  Top 0.406: UEP.3 v63.18,64.43
  Bottom 0.406: P3.4 67.31,65.72 66.36,64.77 64.77,64.77 64.43,64.43 v63.18,64.43
EDO
  Top 0.406: P3.1 67.31,58.1 66.36,57.15 60.96,57.15 60.01,58.1 60.01,65.72 60.8,66.51 UEP.4
EECS  (via drill 0.64 pad 1.02)
  Top 0.305: U2.03 11.75,10.16 12.7,11.11 20.95,11.11 v21.59,10.48
  Top 0.406: v21.59,13.65 23.81,15.88 39.69,15.88 40.96,17.14 41.59,17.14
  Top 0.813: J3.6 41.59,17.14
  Bottom 0.406: v21.59,10.48 v21.59,13.65
EEDO  (via drill 0.64 pad 1.02)
  Top 0.305: U2.04 13.02,10.16 13.34,10.48 19.68,10.48 20.95,9.21 22.23,9.21 22.86,9.84
  Top 0.406: 22.86,9.84 26.04,13.02 41.59,13.02 41.91,12.7 47.31,12.7 v48.9,14.29 | R16.2 54.67,19.3 55.56,18.41
  Top 0.813: J3.1 56.2,17.78 55.56,18.41
  Bottom 0.406: v48.9,14.29 49.53,14.92 54.61,14.92 55.24,15.56
  Bottom 0.813: J3.1 56.2,16.51 55.24,15.56
EGND  (via drill 0.64 pad 1.02)
  Top 0.61: CE.2 62.55,58.74 61.91,59.37 UEP.5 61.91,62.87 | 61.91,62.87 v61.91,63.82 | 61.91,62.87 63.18,62.87 | 63.18,62.87 64.45,62.87 | 64.45,62.87 65.09,63.5 v66.04,63.5 | UEP.7 64.45,62.87 | UEP.6 63.18,62.87
  Top 0.813: v63.82,70.8 63.82,68.96 RE.1
  Top 1.27: P3.3 67.31,63.18 66.99,63.5 v66.04,63.5
  pour Bottom (isolate 0.254): 60.64,56.52 70.8,56.52 71.44,57.15 71.44,71.75 70.8,72.39 60.64,72.39 60.01,71.75 60.01,57.15
FB
  Top 0.305: U1.5 23.34,28.73 23.5,28.57 24.45,28.57 24.77,28.26 24.77,24.45 26.99,22.23 R8.1 28.19,23.81 | R7.1 28.19,23.81 | 28.89,23.81 28.19,23.81
  Top 0.406: R10.2 32.38,23.5 32.07,23.81 28.89,23.81
GND  (via drill 0.64 pad 1.02, 2.77 pad 2.54)
  Top 0.305: R7.2 30.23,27.24
  Top 0.406: C9.2 22.23,27.3 | C8.2 18.73,24.77 | 6.03,27.88 C4.2 | U3.2 47.31,26.99 47.62,26.67 47.62,25.4 46.99,24.77 | 50.48,28.59 50.48,27.94 50.8,27.62 51.12,27.62 | 50.48,28.59 50.48,33.34 v48.9,34.92 | C13.2 53.34,27.3 53.02,27.62 51.12,27.62 | R15.2 51.12,27.62 | C7.2 20,20.95 | D2.1 50.48,28.59 | R13.2 40.96,23.5 | C18.2 43.18,23.81
  Top 0.61: U1.7 v25.72,32.07 | U4.2 v4.13,23.5 | R4.2 10.16,18.41 9.21,17.46 9.21,16.51 | 9.21,16.51 9.21,15.24 | C16.2 9.21,16.51
  Top 0.813: S1.1 71.02,11.01 v70.48,10.48 | S1.2 71.02,19.79 v70.48,20.32 | R5.2 19.05,18.41 20,19.37 20,20.95 20,21.91 v18.41,23.5
  Top 1.676: 3.49,41.91 4.76,41.91 6.03,43.18 6.03,45.72 | 3.49,30.48 3.49,28.26 v3.81,27.94
  other vias: 23.5,44.13 17.78,44.13 17.46,35.56 23.18,35.24 20.32,35.24 20.64,44.13 5.71,46.35 14.29,46.35 37.47,25.4 29.84,30.8 32.07,27.3 20.32,27.62 18.41,26.35 49.85,43.81 37.78,20.64 7.62,14.29 20.32,31.43 46.67,24.13
  pour Top (isolate 0.406, rank 4, no thermals): 16.83,35.24 16.83,41.91 14.61,44.13 7.3,44.13 6.67,43.5 5.71,43.5 4.76,44.45 4.76,46.67 5.4,47.31 23.81,47.31 24.45,46.67 24.45,34.61 24.13,34.29 21.91,34.29 21.59,33.97 21.59,28.57 22.86,27.3 21.59,26.04 19.05,26.04 19.05,25.08 19.37,24.77 19.05,24.45 19.05,22.54 16.51,22.54 16.19,22.86 16.19,28.57 18.73,28.57 19.05,28.89 19.05,33.97 18.1,34.92 17.14,34.92
  pour Bottom (isolate 0.406, no thermals): 0.95,1.59 0.95,17.78 2.86,19.68 2.54,46.99 2.86,47.31 71.12,47.31 71.44,46.99 71.44,16.83 71.12,16.51 68.58,16.51 68.26,16.19 68.26,14.29 68.58,13.97 71.12,13.97 71.44,13.65 71.44,6.35 70.8,5.71 67.94,5.71 66.36,4.13 66.36,1.59 65.72,0.95 1.59,0.95
  pour Top (isolate 0.406, rank 4, no thermals): 25.08,32.07 26.35,33.34 29.84,33.34 30.16,33.02 30.16,30.48 30.8,29.84 38.42,29.84 39.69,28.57 39.69,26.35 38.1,24.77 33.02,24.77 31.11,26.67 30.54,26.67 30.23,26.35 29.91,26.67 28.26,26.67 27.94,27.3 27.94,29.21 27.3,29.84 24.77,32.07
  pour Top (isolate 0.406, rank 4, no thermals): 46.67,36.2 46.67,34.61 47.94,34.61 48.58,33.97 49.85,33.97 49.53,34.29 49.53,42.23 50.48,43.18 50.48,44.13 50.16,44.45 47.62,44.45 46.99,43.81 46.99,36.51
  pour Top (isolate 0.406, rank 4, no thermals): 4.45,22.86 5.08,23.5 4.45,24.13 4.45,24.77 6.35,26.67 6.35,28.57 3.49,28.57 2.86,27.94 2.86,20.64 3.81,19.68 6.67,19.68 6.99,20 6.99,21.27 6.67,21.59 5.08,21.59 4.45,22.23
  pour Top (isolate 0.406, rank 4, no thermals): 6.03,11.75 8.57,11.75 9.53,12.7 9.53,15.88 9.21,16.19 8.57,15.56 7.62,15.56 6.67,14.61 6.67,13.65 6.03,13.02
  pour Top (isolate 0.406, no thermals): 38.1,19.37 35.56,19.37 35.24,19.68 35.24,21.59 35.56,21.91 37.78,21.91 40.96,25.08 47.31,25.08 47.62,25.4 47.62,22.54 47.31,22.23 45.09,22.23 43.81,23.5 43.5,23.5 43.18,23.18 42.86,23.5 41.59,23.5 40.96,22.86 40.64,23.18 40.32,23.18 39.69,22.54 39.69,21.91 38.42,20.64 38.42,19.68
IFAN
  Top 0.406: R14.2 48.9,22.54 | 48.9,22.54 51.12,22.54 | 51.12,22.54 53.02,22.54 53.34,22.86 C13.1 | R15.1 51.12,22.54 | 48.9,22.54 47.31,20.95 40.01,20.95 39.37,20.32 39.37,19.05 38.42,18.1 22.23,18.1 20,15.88 17.14,15.88 16.83,15.56 U2.08
J2-3  (via drill 0.89 pad 1.68)
  Top 0.61: v58.42,33.02 54.61,33.02 52.07,35.56 J2-WHI.1
J2-4  (via drill 0.89 pad 1.68)
  Top 0.61: v58.42,35.56 56.52,35.56 55.88,36.2 J2-BLK.1
N$1
  Top 0.406: R2.2 13.97,34.61 15.88,36.51 15.88,40.32 14.29,41.91
  pour Top (isolate 0.406, rank 6, no thermals): 7.94,41.27 14.92,41.27 14.61,41.59 14.61,42.86 14.29,43.18 7.94,43.18 7.62,42.86 7.62,41.59
N$3
  Top 0.61: P3.2 66.99,60.64 66.51,61.12 UEP.8 65.72,59.83 65.47,59.58 CE.1
N$4
  Top 0.406: R12.1 47.62,32.38 | U3.5 44.78,26.05 45.09,26.35 45.09,29.84
  pour Top (isolate 0.406, no thermals): 43.18,41.27 43.18,29.53 43.5,29.21 44.77,29.21 45.09,28.89 45.4,29.21 47.62,29.21 47.94,29.53 47.94,32.07 48.26,32.38 47.94,32.7 47.94,33.34 47.62,33.66 46.04,33.66 45.72,33.97 45.72,41.27 45.4,41.59 43.5,41.59
N$5  (via drill 0.64 pad 1.02)
  Top 0.406: R12.2 52.7,32.38 53.34,31.75 53.34,28.89 54.93,27.3 54.93,22.86 53.66,21.59 49.53,21.59 47.88,19.94 C18.1 R13.1 40.96,18.73 39.05,16.83 22.54,16.83 v19.37,13.65 | U2.07 17.63,8.74 18.1,9.21 v19.37,9.21
  Bottom 0.406: v19.37,13.65 v19.37,9.21
N$6
  Top 0.406: U3.3 47.93,27.93 47.94,27.94 48.9,27.94 | 48.9,27.94 R14.1 | D2.3 49.39,28.43 48.9,27.94
N$7  (via drill 0.64 pad 1.02)
  other vias: 60.96,38.1
N$8  (via drill 0.64 pad 1.02)
  other vias: 60.96,35.56
N$9
  Top 0.406: C8.1 22.86,24.77 22.86,25.4 R6.2
N$10  (via drill 0.64 pad 1.02)
  other vias: 60.96,33.02
N$11  (via drill 0.64 pad 1.02)
  other vias: 60.96,30.48
N$13  (via drill 0.64 pad 1.02)
  other vias: 60.96,27.94
N$15  (via drill 0.64 pad 1.02)
  other vias: 60.96,25.4
N$16  (via drill 0.64 pad 1.02)
  other vias: 66.04,25.4
N$17  (via drill 0.64 pad 1.02)
  other vias: 66.04,27.94
N$18  (via drill 0.64 pad 1.02)
  other vias: 66.04,30.48
N$19  (via drill 0.64 pad 1.02)
  other vias: 66.04,33.02
N$20  (via drill 0.64 pad 1.02)
  other vias: 66.04,35.56
N$21  (via drill 0.64 pad 1.02)
  other vias: 66.04,38.1
N$22  (via drill 0.64 pad 1.02)
  other vias: 66.04,40.64
N$23  (via drill 0.64 pad 1.02)
  other vias: 63.5,40.64
N$24  (via drill 0.64 pad 1.02)
  other vias: 63.5,38.1
N$25  (via drill 0.64 pad 1.02)
  other vias: 63.5,35.56
N$26  (via drill 0.64 pad 1.02)
  other vias: 63.5,33.02
N$27  (via drill 0.64 pad 1.02)
  other vias: 63.5,30.48
N$28  (via drill 0.64 pad 1.02)
  other vias: 63.5,27.94
N$29  (via drill 0.64 pad 1.02)
  other vias: 63.5,25.4
N$30  (via drill 0.64 pad 1.02)
  other vias: 60.96,40.64
N$31  (via drill 0.64 pad 1.02)
  other vias: 58.42,40.64
N$32  (via drill 0.64 pad 1.02)
  other vias: 58.42,38.1
N$33  (via drill 0.64 pad 1.02)
  other vias: 58.42,30.48
N$34  (via drill 0.64 pad 1.02)
  other vias: 58.42,27.94
N$35  (via drill 0.64 pad 1.02)
  other vias: 66.04,22.86
N$36  (via drill 0.64 pad 1.02)
  other vias: 63.5,22.86
N$37  (via drill 0.64 pad 1.02)
  other vias: 60.96,22.86
N$38  (via drill 0.64 pad 1.02)
  other vias: 58.42,22.86
N$42
  Bottom 1.016: FAN.2 49.21,50.48 49.53,50.8 53.25,50.8 JC1.1
N$43
  Bottom 1.016: JC1.2 50.41,54.85 48.58,53.02 FAN.1
N$44  (via drill 0.64 pad 1.27)
  Bottom 0.61: v39.5,67.3 39.5,64.96 43.81,60.64 JP1.2
  Bottom 1.016: JC1.3 50.41,58.81 48.58,60.64 JP1.2
N$45  (via drill 0.64 pad 1.27)
  Bottom 0.61: v39.5,70.7 40.74,70.7 41.27,70.17 41.27,65.72 43.81,63.18 JP1.1
  Bottom 1.016: JP1.1 49.21,63.18 49.53,62.87 53.25,62.87 JC1.4
OUT+
  Top 0.406: R10.1 38.1,23.5 40.96,26.35 40.96,28.89 | U3.4 41.59,27.93
  pour Top (isolate 0.406, no thermals): 33.34,39.37 33.34,35.24 30.8,32.7 30.8,30.8 31.11,30.48 39.05,30.48 40.64,28.89 40.64,26.04 41.91,26.04 42.23,26.35 42.23,27.62 42.55,27.94 42.23,28.26 42.23,39.37 41.91,39.69 33.66,39.69
OUT-EN
  Top 0.305: U1.3 15.88,30.8 14.92,29.84 14.92,22.54 14.61,22.23 14.61,20.95 14.92,20.64
  Top 0.406: 14.92,20.64 15.18,20.38 R5.1 15.18,16.45 14.29,15.56 U2.10
PB  (via drill 0.64 pad 1.02)
  Top 0.406: U2.02 10.48,6.35 | 10.48,6.35 10.48,5.71 11.11,5.08 50.16,5.08 50.48,5.4 v51.75,5.4 | R17.2 10.48,6.35 | S1.4 67.63,13.41 | 67.63,13.41 67.63,17.01 S1.3 | 67.63,13.41 67.63,6.99 66.04,5.4 v55.56,5.4
  Bottom 0.406: v51.75,5.4 v55.56,5.4
PGMCLK
  Top 0.305: U2.12 11.75,12.7 12.06,12.38 22.23,12.38 22.54,12.7
  Top 0.406: 22.54,12.7 24.77,14.92 42.23,14.92 42.55,14.61 44.13,14.61 45.09,15.56
  Top 0.813: J3.5 46.04,16.51 45.09,15.56
PGMDAT
  Top 0.305: U2.13 10.48,12.7 11.43,11.75 22.86,11.75 23.18,12.06
  Top 0.406: 23.18,12.06 25.08,13.97 41.91,13.97 42.23,13.65 45.72,13.65 46.99,14.92
  Top 0.813: J3.4 48.58,16.51 46.99,14.92
PWMF
  Top 0.406: R9.1 32.38,20
  Top 0.61: R8.2 31.75,22.23 32.7,21.27
  pour Top (isolate 0.406, no thermals): 33.66,19.37 33.97,19.68 33.97,21.59 33.66,21.91 32.07,21.91 32.07,20.32 31.75,20 32.38,19.37
SS
  Top 0.305: U1.4 15.88,29.53 15.56,29.21 15.56,21.91
  Top 0.406: 15.56,21.91 15.56,21.27 15.88,20.95 C7.1
SW
  Top 0.61: U1.8 25.08,33.34 26.35,34.61
  pour Top (isolate 0.406, no thermals): 25.4,39.37 25.4,33.66 26.04,34.29 31.11,34.29 32.38,35.56 32.38,39.37 32.07,39.69 25.72,39.69
U2-05  (via drill 0.64 pad 1.42)
  Top 0.406: U2.05 14.29,6.99 15.24,6.03 22.23,6.03 22.86,6.67 v24.77,6.67
U2-06  (via drill 0.64 pad 1.42)
  Top 0.406: U2.06 15.56,7.3 15.88,6.99 21.59,6.99 23.5,8.89 v24.77,8.89
VBAT
  Top 0.305: U2.11 13.02,15.56 13.08,15.62 C16.1 R4.1 R3.2
VCTL
  Top 0.406: U2.09 15.56,15.56 16.83,16.83 19.37,16.83 22.54,20 R9.2
VM1  (via drill 0.89 pad 1.42)
  other vias: 39.5,69
VM2  (via drill 0.89 pad 1.42)
  other vias: 49.5,69

### Text on the board
Bottom: JRH | PAPRB rA
tPlace: PAPR | BATT | BRN | BLU | WHI | BLK | J2
Measures: 0.82 x 1.00
_tNames: RE | P1 | UEP | JP1 | JC1 | CE | FAN | Q1 | J1 | R1 | C1 | L1 | C2 | C3 | D1 | R2 | U1 | R12 | C10 | C4 | D2 | C5 | R11 | C9 | U4 | C11 | C12 | C6 | R7 | U3 | C13 | R3 | R6 | R8 | R10 | R14 | C8 | R15 | R9 | C7 | C18 | R16 | C14 | R4 | R13 | R5 | C17 | J3 | S1 | C16 | C15 | U2 | R17